# EAGLE board serv_open8_sotb (EAGLE 9.6.2), part 1 of 2
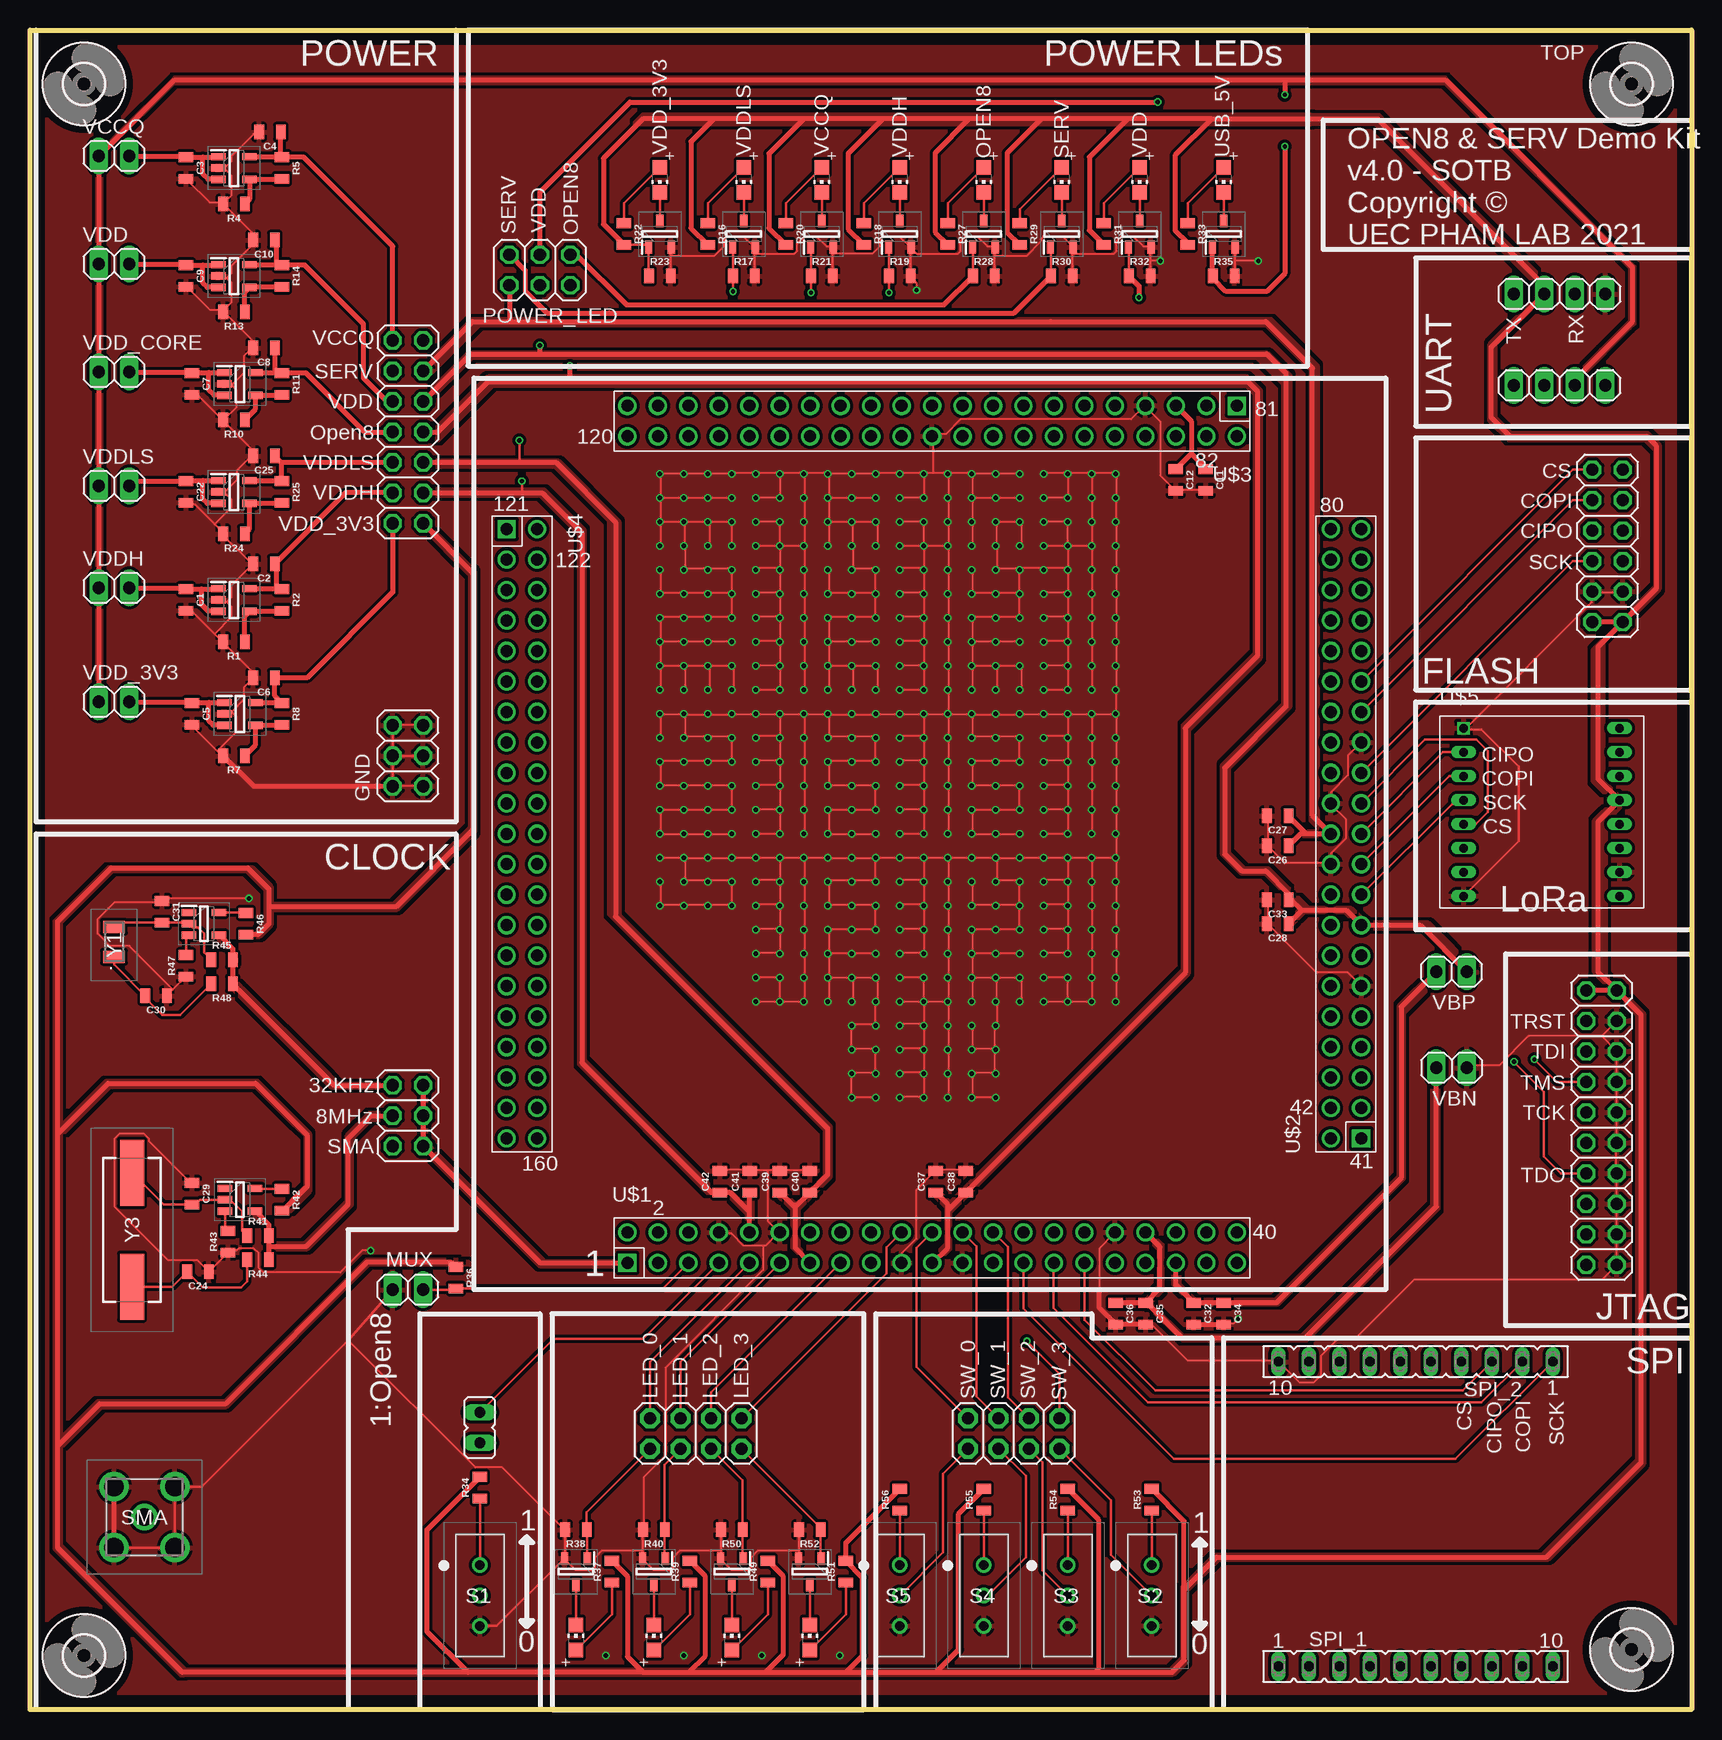
[diagram p5: board, top side]
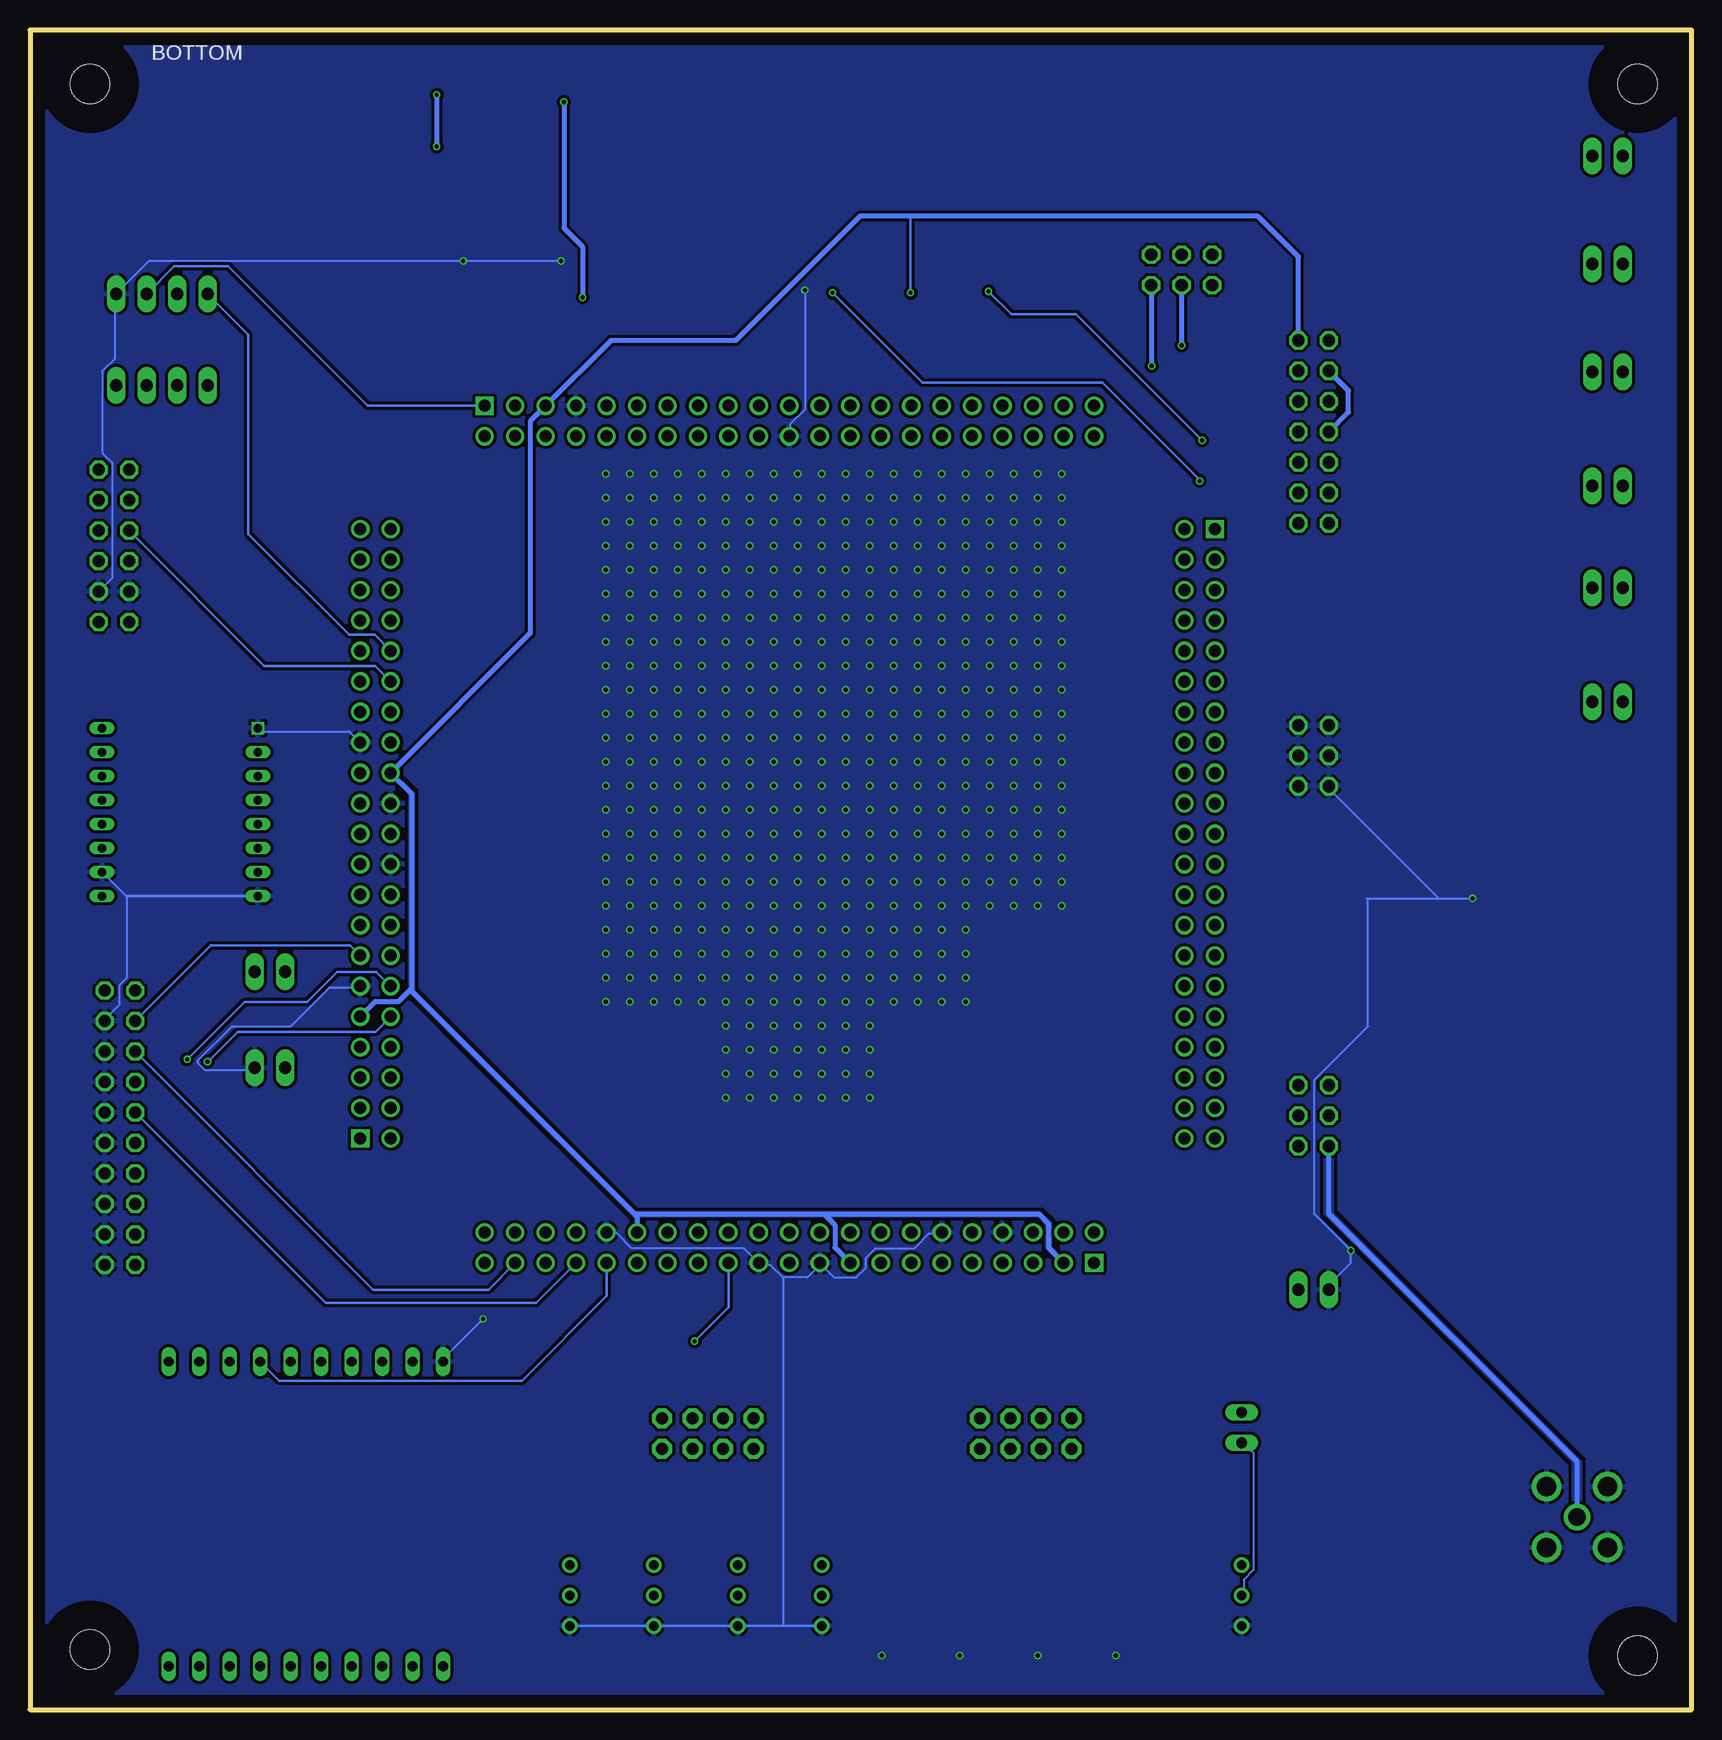
[diagram p6: board, bottom side, seen from below]

Size 138.5 x 140 mm. Coordinates in mm from the lower left corner, seen from the top.
Outline: 0,140 138.5,140 138.5,0 0,0 0,140
Copper layers (1*16): Top 0.035mm / dielectric 1.5mm / Bottom 0.035mm
Design rules "default *": minimum track width 6mil, minimum drill 0.35mm, track to track 10mil, track to pad 10mil, pad to pad 6mil, via to via 10mil, smd to smd 10mil, copper to edge 40mil, drill to drill 6mil, minimum pad ring 0.13mm, minimum via ring 0.13mm, stop-mask expansion 4mil, vias tented up to drill 0mil, thermal gap 10mil

## Footprints (pad centres in the part's own frame; a part is rotated, then mirrored left to right if it is on the bottom)
2X10 = drill 1.016 octagon: 1 -11.43,-1.27; 2 -11.43,1.27; 3 -8.89,-1.27; 4 -8.89,1.27; 5 -6.35,-1.27; 6 -6.35,1.27; 7 -3.81,-1.27; 8 -3.81,1.27; 9 -1.27,-1.27; 10 -1.27,1.27; 11 1.27,-1.27; 12 1.27,1.27; 13 3.81,-1.27; 14 3.81,1.27; 15 6.35,-1.27; 16 6.35,1.27; 17 8.89,-1.27; 18 8.89,1.27; 19 11.43,-1.27; 20 11.43,1.27
0805 = smd 0.8 x 1.2: 1 -0.9,0; 2 0.9,0
2X03 = drill 1.016 octagon: 1 -2.54,-1.27; 2 -2.54,1.27; 3 0,-1.27; 4 0,1.27; 5 2.54,-1.27; 6 2.54,1.27
2X06 = drill 1.016 octagon: 1 -6.35,-1.27; 2 -6.35,1.27; 3 -3.81,-1.27; 4 -3.81,1.27; 5 -1.27,-1.27; 6 -1.27,1.27; 7 1.27,-1.27; 8 1.27,1.27; 9 3.81,-1.27; 10 3.81,1.27; 11 6.35,-1.27; 12 6.35,1.27
3,3 = hole 3.3: 0,0
SOT95P285X145-5N = smd 1.2 x 0.6: 1 -1.3,0.95; 2 -1.3,0; 3 -1.3,-0.95; 4 1.3,-0.95; 5 1.3,0.95
SOT95P280X145-5N = smd 1.2 x 0.6: 1 -1.25,0.95; 2 -1.25,0; 3 -1.25,-0.95; 4 1.25,-0.95; 5 1.25,0.95
2X04 = drill 1.016 pad 1.676 octagon: 1 -3.81,-1.27; 2 -3.81,1.27; 3 -1.27,-1.27; 4 -1.27,1.27; 5 1.27,-1.27; 6 1.27,1.27; 7 3.81,-1.27; 8 3.81,1.27
CHIP-LED0805 = smd 1.2 x 1.2: A 0,-1.05; C 0,1.05
1X02 = drill 1.016 long: 1 -1.27,0; 2 1.27,0
2X07 = drill 1.016 octagon: 1 -7.62,-1.27; 2 -7.62,1.27; 3 -5.08,-1.27; 4 -5.08,1.27; 5 -2.54,-1.27; 6 -2.54,1.27; 7 0,-1.27; 8 0,1.27; 9 2.54,-1.27; 10 2.54,1.27; 11 5.08,-1.27; 12 5.08,1.27; 13 7.62,-1.27; 14 7.62,1.27
SOT95P230X110-3N = smd 1.05 x 0.6: 1 -1.1,0.95; 2 -1.1,-0.95; 3 1.1,0
JP1 = drill 0.914 long: 1 0,-1.27; 2 0,1.27
SS12SDP2 = drill 0.8 pad 1.3: 1 0,2.54; 2 0,0; 3 0,-2.54
29856004 = drill 1.64 pad 2.46: 1 0,0; 2 5.08,0; 3 5.08,5.08; 4 0,5.08 | drill 1.47 pad 2.205: 5 2.54,2.54
FE10 = drill 0.813 long: 1 -11.43,0; 2 -8.89,0; 3 -6.35,0; 4 -3.81,0; 5 -1.27,0; 6 1.27,0; 7 3.81,0; 8 6.35,0; 9 8.89,0; 10 11.43,0
2X41_HEADER = drill 1 pad 1.524 square: 1 -25.4,-1.27 | drill 1 pad 1.524: 2 -25.4,1.27; 3 -22.86,-1.27; 4 -22.86,1.27; 5 -20.32,-1.27; 6 -20.32,1.27; 7 -17.78,-1.27; 8 -17.78,1.27; 9 -15.24,-1.27; 10 -15.24,1.27; 11 -12.7,-1.27; 12 -12.7,1.27; 13 -10.16,-1.27; 14 -10.16,1.27; 15 -7.62,-1.27; 16 -7.62,1.27; 17 -5.08,-1.27; 18 -5.08,1.27; 19 -2.54,-1.27; 20 -2.54,1.27; 21 0,-1.27; 22 0,1.27; 23 2.54,-1.27; 24 2.54,1.27; 25 5.08,-1.27; 26 5.08,1.27; 27 7.62,-1.27; 28 7.62,1.27; 29 10.16,-1.27; 30 10.16,1.27; 31 12.7,-1.27; 32 12.7,1.27; 33 15.24,-1.27; 34 15.24,1.27; 35 17.78,-1.27; 36 17.78,1.27; 37 20.32,-1.27; 38 20.32,1.27; 39 22.86,-1.27; 40 22.86,1.27; 41 25.4,-1.27; 42 25.4,1.27
RFM95W-915S2 = drill 0.7 square: P$1 -6,5 | drill 0.7 long: P$2 -6,3; P$3 -6,1; P$4 -6,-1; P$5 -6,-3; P$6 -6,-5; P$7 -6,-7; P$8 -6,-9; P$9 7,5; P$10 7,3; P$11 7,1; P$12 7,-1; P$13 7,-3; P$14 7,-5; P$15 7,-7; P$16 7,-9
1X04 = drill 1.016 long: 1 -3.81,0; 2 -1.27,0; 3 1.27,0; 4 3.81,0
Q13FC1350000400 = smd 1 x 1.8: 1 -1.25,0; 2 1.25,0
HC49SM8MHZ20PF30PPM = smd 5.5 x 2: 1 -4.75,0; 2 4.75,0

## Placement (x,y rotation side)
ALL_JTAG  [2X10]  131,48.5 270 top
C1  1.0uF  [0805]  13,92.5 270 top
C2  4.7uF  [0805]  19.5,95.5 180 top
C3  1.0uF  [0805]  13,128.5 270 top
C4  4.7uF  [0805]  20,131.5 180 top
C5  1.0uF  [0805]  13.5,83 270 top
C6  4.7uF  [0805]  19.5,86 180 top
C7  1.0uF  [0805]  13.5,110.5 270 top
C8  4.7uF  [0805]  19.5,113.5 180 top
C9  1.0uF  [0805]  13,119.5 270 top
C10  4.7uF  [0805]  19.5,122.5 180 top
C11  10uF  [0805]  98,102.5 270 top
C12  0.1uF  [0805]  95.5,102.5 270 top
C22  1.0uF  [0805]  13,101.5 270 top
C24  36pF  [0805]  14,36.5 180 top
C25  4.7uF  [0805]  19.5,104.5 180 top
C26  10uF  [0805]  104,72 180 top
C27  0.1uF  [0805]  104,74.5 180 top
C28  10uF  [0805]  104,65.5 180 top
C29  36pF  [0805]  13.5,43 270 top
C30  22pF  [0805]  10.5,59.5 180 top
C31  22pF  [0805]  11,66.5 270 top
C32  10uF  [0805]  97,33 270 top
C33  0.1uF  [0805]  104,67.5 180 top
C34  0.1uF  [0805]  99.5,33 270 top
C35  10uF  [0805]  93,33 270 top
C36  0.1uF  [0805]  90.5,33 270 top
C37  10uF  [0805]  75.5,44 90 top
C38  0.1uF  [0805]  78,44 90 top
C39  10uF  [0805]  62.5,44 90 top
C40  0.1uF  [0805]  65,44 90 top
C41  10uF  [0805]  60,44 90 top
C42  0.1uF  [0805]  57.5,44 90 top
CLOCK  PINHD-2X3  [2X03]  31.5,49.5 270 top
FLASH  PINHD-2X6  [2X06]  131.5,97 90 top
GND  PINHD-2X3  [2X03]  31.5,79.5 90 top
H1  MOUNT-HOLE3.3  [3,3]  4.5,4.5 0 top
H2  MOUNT-HOLE3.3  [3,3]  133.5,5 0 top
H3  MOUNT-HOLE3.3  [3,3]  133.5,135.5 0 top
H4  MOUNT-HOLE3.3  [3,3]  4.5,135.5 0 top
IC1  AP7331-WG-7  [SOT95P285X145-5N]  17,101.5 0 top
IC2  AP7331-WG-7  [SOT95P285X145-5N]  17,92.5 0 top
IC5  AP7331-WG-7  [SOT95P285X145-5N]  17,128.5 0 top
IC7  AP7331-WG-7  [SOT95P285X145-5N]  17.5,83 0 top
IC8  AP7331-WG-7  [SOT95P285X145-5N]  17.5,110.5 0 top
IC9  AP7331-WG-7  [SOT95P285X145-5N]  17,119.5 0 top
IC12  SN74LVC1GU04DBVR  [SOT95P280X145-5N]  17.5,42.5 0 top
IC13  SN74LVC1GU04DBVR  [SOT95P280X145-5N]  14.5,65.5 0 top
LED  [2X04]  55.5,23 180 top
LED1  [CHIP-LED0805]  59.5,127.5 180 top
LED2  [CHIP-LED0805]  72.5,127.5 180 top
LED3  [CHIP-LED0805]  66,127.5 180 top
LED4  [CHIP-LED0805]  52.5,127.5 180 top
LED5  [CHIP-LED0805]  79.5,127.5 180 top
LED6  [CHIP-LED0805]  86,127.5 180 top
LED7  [CHIP-LED0805]  92.5,127.5 180 top
LED8  [CHIP-LED0805]  99.5,127.5 180 top
LED9  [CHIP-LED0805]  45.5,6 0 top
LED10  [CHIP-LED0805]  52,6 0 top
LED11  [CHIP-LED0805]  58.5,6 0 top
LED12  [CHIP-LED0805]  65,6 0 top
MUX  [1X02]  31.5,35 180 top
POWER  [2X07]  31.5,106.5 270 top
POWER_LED  PINHD-2X3  [2X03]  42.5,120 0 top
Q1  BSH103,235  [SOT95P230X110-3N]  72.5,123 90 top
Q2  BSH103,235  [SOT95P230X110-3N]  66,123 90 top
Q3  BSH103,235  [SOT95P230X110-3N]  59.5,123 90 top
Q4  BSH103,235  [SOT95P230X110-3N]  52.5,123 90 top
Q5  BSH103,235  [SOT95P230X110-3N]  79.5,123 90 top
Q6  BSH103,235  [SOT95P230X110-3N]  86,123 90 top
Q7  BSH103,235  [SOT95P230X110-3N]  92.5,123 90 top
Q8  BSH103,235  [SOT95P230X110-3N]  99.5,123 90 top
Q9  BSH103,235  [SOT95P230X110-3N]  45.5,11.5 270 top
Q10  BSH103,235  [SOT95P230X110-3N]  52,11.5 270 top
Q11  BSH103,235  [SOT95P230X110-3N]  58.5,11.5 270 top
Q12  BSH103,235  [SOT95P230X110-3N]  65,11.5 270 top
R1  66.5k  [0805]  17,89 180 top
R2  133k  [0805]  21,92.5 270 top
R4  66.5k  [0805]  17,125.5 180 top
R5  482k  [0805]  21,128.5 270 top
R7  66.5k  [0805]  17,79.5 180 top
R8  482k  [0805]  21,83 270 top
R10  66.5k  [0805]  17,107.5 180 top
R11  133k  [0805]  21,110.5 270 top
R13  66.5k  [0805]  17,116.5 180 top
R14  133k  [0805]  21,119.5 270 top
R16  330  [0805]  56.5,123 270 top
R17  10k  [0805]  59.5,119.5 0 top
R18  330  [0805]  69.5,123 270 top
R19  10k  [0805]  72.5,119.5 0 top
R20  330  [0805]  63,123 270 top
R21  10k  [0805]  66,119.5 0 top
R22  330  [0805]  49.5,123 270 top
R23  10k  [0805]  52.5,119.5 0 top
R24  66.5k  [0805]  17,98 180 top
R25  66.5k  [0805]  21,101.5 270 top
R27  330  [0805]  76.5,123 270 top
R28  10k  [0805]  79.5,119.5 0 top
R29  330  [0805]  82.5,123 270 top
R30  10k  [0805]  86,119.5 0 top
R31  330  [0805]  89.5,123 270 top
R32  10k  [0805]  92.5,119.5 0 top
R33  330  [0805]  96.5,123 270 top
R34  10k  [0805]  37.5,18.5 90 top
R35  10k  [0805]  99.5,119.5 0 top
R36  10k  [0805]  35.5,36 270 top
R37  330  [0805]  48.5,11.5 90 top
R38  10k  [0805]  45.5,15 180 top
R39  330  [0805]  55,11.5 90 top
R40  10k  [0805]  52,15 180 top
R41  10M  [0805]  19,39.5 0 top
R42  47k  [0805]  21,42.5 270 top
R43  47k  [0805]  16.5,39 90 top
R44  2k  [0805]  19,37.5 180 top
R45  10M  [0805]  16,62.5 0 top
R46  47k  [0805]  18,65.5 270 top
R47  47k  [0805]  13,62 90 top
R48  300k  [0805]  16,60.5 180 top
R49  330  [0805]  61.5,11.5 90 top
R50  10k  [0805]  58.5,15 180 top
R51  330  [0805]  68,11.5 90 top
R52  10k  [0805]  65,15 180 top
R53  10k  [0805]  93.5,17.5 90 top
R54  10k  [0805]  86.5,17.5 90 top
R55  10k  [0805]  79.5,17.5 90 top
R56  10k  [0805]  72.5,17.5 90 top
RESET  REG_IN  [JP1]  37.5,23.5 180 top
S1  SS12SDP2  [SS12SDP2]  37.5,9.5 0 top
S2  SS12SDP2  [SS12SDP2]  93.5,9.5 0 top
S3  SS12SDP2  [SS12SDP2]  86.5,9.5 0 top
S4  SS12SDP2  [SS12SDP2]  79.5,9.5 0 top
S5  SS12SDP2  [SS12SDP2]  72.5,9.5 0 top
SMA  2985-6004  [29856004]  7,13.5 0 top
SPI_1  SPI1  [FE10]  115.5,3.6 0 top
SPI_2  SPI0  [FE10]  115.5,29 180 top
SWITCH  [2X04]  82,23 180 top
U$1  [2X41_HEADER]  75.2,38.5 0 top
U$2  [2X41_HEADER]  109.7,73 90 top
U$3  [2X41_HEADER]  75.2,107.4 180 top
U$4  [2X41_HEADER]  41,73 270 top
U$5  [RFM95W-915S2]  125.5,76.8 0 top
USB-UART_1  PINHD-1X4  [1X04]  127.5,118 180 top
USB-UART_2  PINHD-1X4  [1X04]  127.5,110.38 180 top
VBN  PINHD-1X2  [1X02]  118.5,53.5 0 top
VBP  PINHD-1X2  [1X02]  118.5,61.5 180 top
VCCQ  [1X02]  7,129.5 0 top
VDD  [1X02]  7,120.5 0 top
VDD_3V3  [1X02]  7,84 0 top
VDD_CORE  [1X02]  7,111.5 0 top
VDDH  [1X02]  7,93.5 0 top
VDDLS  [1X02]  7,102 0 top
Y1  Q13FC1350000400  [Q13FC1350000400]  7,64 90 top
Y3  HC-49SM8MHZ20PF30PPM  [HC49SM8MHZ20PF30PPM]  8.5,40 90 top